# EAGLE design SR-et-Supply (EAGLE 9.4.2)
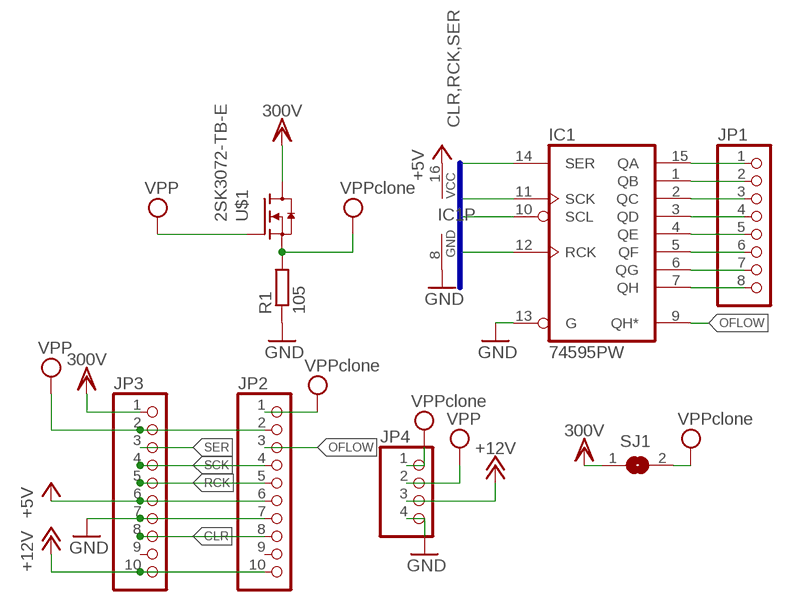
[diagram p0: schematic, sheet 1]

## Parts
IC1  74595PW  [TTSOP16]
JP1  PINHD-1X8  [1X08]
JP2  PINHD-1X10  [1X10]
JP3  PINHD-1X10  [1X10]
JP4  PINHD-1X4  [1X04]
R1  105  R-EU_0204/5  [0204/5]
SJ1  SJ  [SJ]
U$1  2SK3072-TB-E  [SOT95P250X120-3]

## Nets
300V: JP3.1 SJ1.1 U$1.3(D)
+5V: IC1.16(VCC) JP2.6 JP3.6
+12V: JP2.10 JP3.10 JP4.3
CLR: IC1.10(SCL) JP2.8 JP3.8
GND: IC1.8(GND) IC1.13(G) JP2.7 JP3.7 JP4.4 R1.1
N$1: IC1.15(QA) JP1.1
N$2: IC1.1(QB) JP1.2
N$3: IC1.2(QC) JP1.3
N$4: IC1.3(QD) JP1.4
N$5: IC1.4(QE) JP1.5
N$7: IC1.5(QF) JP1.6
N$8: IC1.6(QG) JP1.7
N$9: IC1.7(QH) JP1.8
OFLOW: IC1.9(QH*) JP2.3
RCK: IC1.12(RCK) JP2.5 JP3.5
SCK: IC1.11(SCK) JP2.4 JP3.4
SER: IC1.14(SER) JP3.3
VPP: JP2.2 JP3.2 JP4.2 U$1.1(G)
VPPCLONE: JP2.1 JP4.1 R1.2 SJ1.2 U$1.2(S) ; supply symbol labelled VPPclone
Unconnected: JP2.9 JP3.9

## Buses
CLR,RCK,SER

## Library data of the parts
IC1 = 74xx-eu:74*595: 8-bit SHIFT REGISTER, output latch
JP1 = pinhead:PINHD-1X8: PIN HEADER
JP2 JP3 = pinhead:PINHD-1X10: PIN HEADER
JP4 = pinhead:PINHD-1X4: PIN HEADER
R1 = rcl:R-EU_: RESISTOR, European symbol; SPICEPREFIX: R
SJ1 = jumper:SJ: SMD solder JUMPER
U$1 = Transistor-FET:2SK3072-TB-E: 2SK3072 - N-Channel Silicon MOSFET - General-Purpose Switching Device Applications - Produced by SANYO Semiconductor (now part of On Semiconductor) Features - Ultrahigh-speed switching. - Low-voltage drive. Ordering number : ENN7224A

## Board
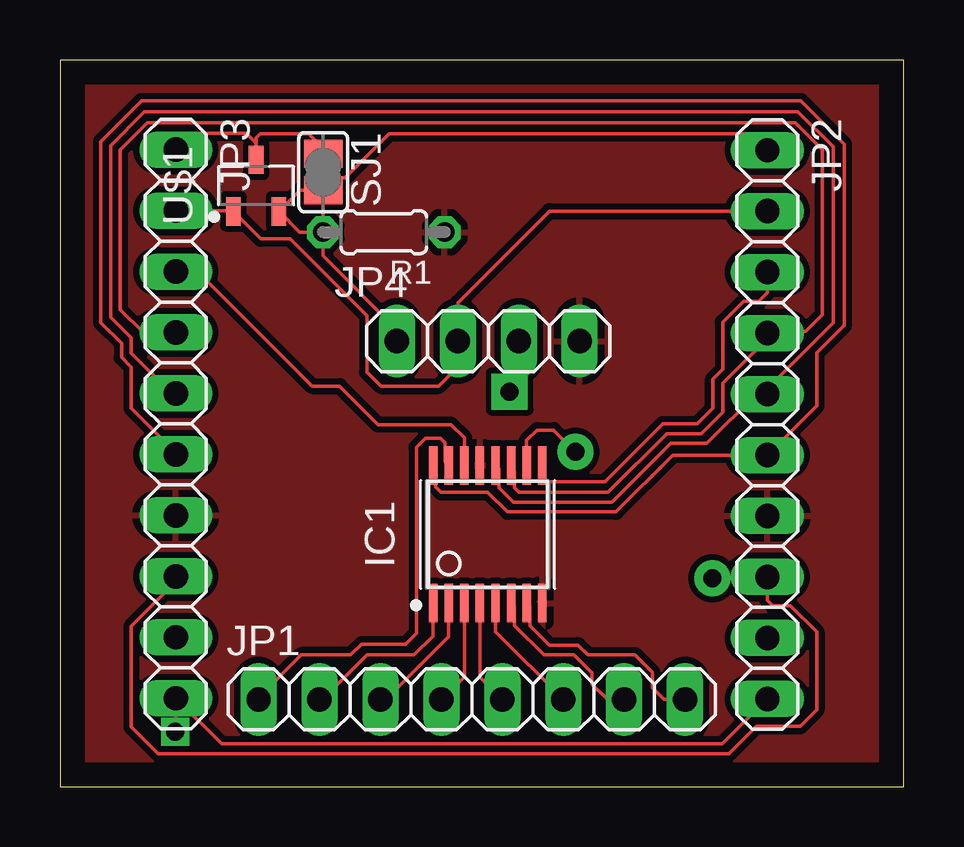
[diagram p1: board, top side]
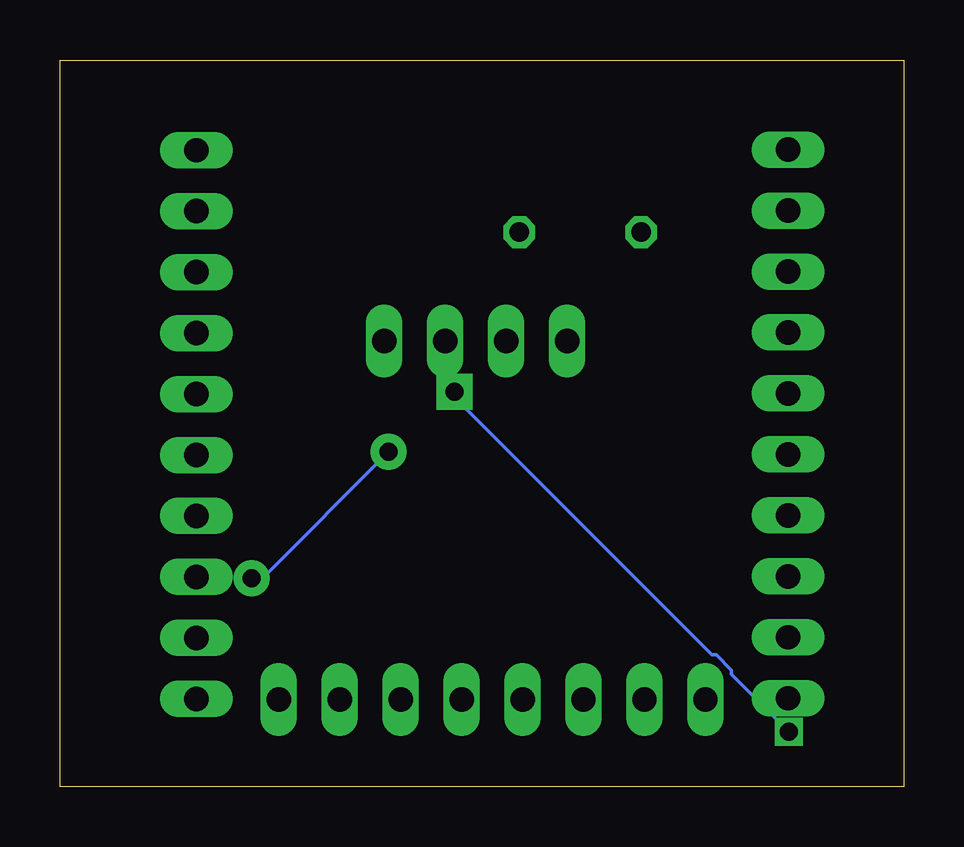
[diagram p2: board, bottom side, seen from below]

Size 35.18 x 30.28 mm. Coordinates in mm from the lower left corner, seen from the top.
Outline: 0,0 35.18,0 35.18,30.28 0,30.28 0,0
Copper layers (1*16): Top 0.035mm / dielectric 1.5mm / Bottom 0.035mm
Design rules "default *": minimum track width 6mil, minimum drill 0.35mm, track to track 10mil, track to pad 10mil, pad to pad 10mil, via to via 10mil, smd to smd 10mil, copper to edge 40mil, drill to drill 6mil, minimum pad ring 10mil, minimum via ring 8mil, stop-mask expansion 4mil, vias tented up to drill 0mil, thermal gap 12mil

### Footprints (pad centres in the part's own frame; a part is rotated, then mirrored left to right if it is on the bottom)
TTSOP16 = smd 1.6 x 0.35: 1 -2.872,2.275; 2 -2.872,1.625; 3 -2.872,0.975; 4 -2.872,0.325; 5 -2.872,-0.325; 6 -2.872,-0.975; 7 -2.872,-1.625; 8 -2.872,-2.275; 9 2.872,-2.275; 10 2.872,-1.625; 11 2.872,-0.975; 12 2.872,-0.325; 13 2.872,0.325; 14 2.872,0.975; 15 2.872,1.625; 16 2.872,2.275
1X08 = drill 1.016 long: 1 -8.89,0; 2 -6.35,0; 3 -3.81,0; 4 -1.27,0; 5 1.27,0; 6 3.81,0; 7 6.35,0; 8 8.89,0
1X10 = drill 1.016 long: 1 -11.43,0; 2 -8.89,0; 3 -6.35,0; 4 -3.81,0; 5 -1.27,0; 6 1.27,0; 7 3.81,0; 8 6.35,0; 9 8.89,0; 10 11.43,0
1X04 = drill 1.016 long: 1 -3.81,0; 2 -1.27,0; 3 1.27,0; 4 3.81,0
0204/5 = drill 0.813 octagon: 1 -2.54,0; 2 2.54,0
SJ = smd 1.168 x 1.6: 1 -0.762,0; 2 0.762,0
SOT95P250X120-3 = smd 1.18 x 0.609: 1 -1.075,0.95; 2 -1.075,-0.95; 3 1.075,0

### Placement (x,y rotation side)
IC1  17.83,10.52 90 top
JP1  17.17,3.63 0 top
JP2  29.49,15.09 270 top
JP3  4.83,15.11 270 top
JP4  17.86,18.57 0 top
R1  13.5,23.1 180 top
SJ1  10.97,25.6 270 top
U$1  8.18,25.04 90 top

### Tracks (layer width: path | path; a pad name or v marks a point on that pad's centre or on a via)
300V
  Top 0.152: JP3.1 5.51,27.23 7.75,27.23 8.18,26.8 U$1.3 8.18,27.03 8.35,27.2 10.36,27.2 10.97,26.59 SJ1.1
+5V
  Top 0.152: IC1.16 15.65,13.29 15.65,12.5 15.89,12.26 17.82,12.26 17.83,12.27 18.66,11.44 23.19,11.44 25.56,13.82 JP2.6 31.55,15.88 31.55,18.07 32.69,19.22 32.69,26.77 30.89,28.57 3.4,28.57 1.7,26.88 1.7,19.33 2.56,18.47 2.56,17.89 2.97,17.48 2.97,15.77 4.83,13.92 JP3.6
+12V  (via drill 0.75 pad 1.15, 0.75 pad 1.5)
  Top 0.152: JP2.10 27.61,1.78 6.73,1.78 JP3.10 4.83,2.31 v4.8,2.29 | v18.75,16.46 18.75,16.92 19.13,17.3 JP4.3
  Bottom 0.152: v18.75,16.46 18.75,16.23 8,5.49 7.83,5.49 7.19,4.85 7.19,4.67 v4.8,2.29
CLR  (via drill 0.75 pad 1.5)
  Top 0.152: JP2.8 29.49,8.69 | 29.49,8.69 29.49,7.77 29.72,7.54 30.45,7.54 31.55,6.45 31.55,3.2 30.86,2.52 29.03,2.52 27.89,1.37 4.09,1.37 2.97,2.49 2.97,6.67 4.83,8.53 JP3.8 | v21.49,13.95 20.57,14.86 19.89,14.86 19.46,14.43 IC1.10 | v27.2,8.69 29.49,8.69
  Bottom 0.152: v27.2,8.69 26.75,8.69 v21.49,13.95
GND
  pour Top: 0,30.18 35.2,30.18 35.2,1.14 33.83,-0.23 0,-0.23
N$1
  Top 0.152: IC1.15 16.06,13.53 16.06,14.32 15.87,14.52 15.24,14.52 14.86,14.13 14.86,6.4 14.4,5.94 12.57,5.94 12.12,5.49 10.06,5.49 8.28,3.71 JP1.1
N$2
  Top 0.152: JP1.2 10.95,3.63 12.8,5.49 14.77,5.49 15.56,6.27 IC1.1
N$3
  Top 0.152: IC1.2 16.21,6.24 13.59,3.63 JP1.3
N$4
  Top 0.152: IC1.3 16.86,4.59 JP1.4
N$5
  Top 0.152: IC1.4 17.51,4.57 JP1.5
N$7
  Top 0.152: IC1.5 18.16,6.46 JP1.6
N$8
  Top 0.152: JP1.7 22.82,3.63 22.17,4.28 22.17,4.75 21.43,5.49 20.17,5.49 18.95,6.71 18.95,7.5 IC1.6
N$9
  Top 0.152: IC1.7 19.6,7.5 19.6,6.71 20.41,5.89 21.6,5.89 22.01,5.49 23.97,5.49 24.69,4.77 24.69,4.12 25.17,3.63 JP1.8
OFLOW
  Top 0.152: IC1.9 20.11,12.93 20.33,12.7 22.72,12.7 25.13,15.11 26.57,15.11 27.23,15.77 27.23,16.98 27.64,17.39 27.64,19.36 28.5,20.22 29.13,20.22 29.49,20.57 JP2.3 29.49,21.21
RCK
  Top 0.152: IC1.12 18.3,13.24 18.3,12.45 18.9,11.85 23.02,11.85 25.47,14.3 26.98,14.3 29.03,16.36 JP2.5 29.46,16.38 29.46,16.57 32.23,19.33 32.23,26.66 30.77,28.12 3.52,28.12 2.11,26.71 2.11,19.56 2.97,18.7 2.97,18.06 4.65,16.38 JP3.5
SCK
  Top 0.152: IC1.11 18.75,13.33 18.95,13.12 18.95,12.45 19.14,12.26 22.85,12.26 25.3,14.71 26.75,14.71 27.64,15.6 27.64,16.81 29.49,18.66 JP2.4 29.57,18.97 31.09,18.97 31.77,19.66 31.77,26.54 30.65,27.66 3.64,27.66 2.52,26.54 2.52,19.87 3.46,18.92 JP3.4
SER
  Top 0.152: JP3.3 5.74,21.46 10.52,16.69 11.66,16.69 13.26,15.09 16.3,15.09 16.86,14.53 IC1.14
VPP
  Top 0.152: JP3.2 7.2,24 U$1.1 8.37,22.83 9.6,22.83 12.8,19.62 12.8,17.28 13.39,16.69 15.77,16.69 16.59,17.5 JP4.2 16.59,20.17 20.4,23.98 JP2.2
VPPCLONE
  Top 0.152: 10.96,23.09 R1.2 10,23.1 U$1.2 10,24.84 SJ1.2 | 10.96,23.09 10.96,22.11 14.05,19.02 JP4.1 | JP2.1 28.8,27.2 13.72,27.2 11.89,25.38 11.43,25.38 10.97,24.92 SJ1.2 | SJ1.2 10.97,23.1 10.96,23.09